# Altium schematic sheet USB HOST.SchDoc: USB HOST
size A4; Date: 30 08 2013; Author: Rachid AKKOUCHE; CompanyName: RASoftware; DrawnBy: Rachid AKKOUCHE; Engineer: Rachid AKKOUCHE; Organization: RASoftware; Address1: 52 J03, rue de la crèche; Address2: 77100 MEAUX; Address3: FRANCE; DocumentNumber: BRA201308309C; Revision: C; SheetNumber: 9; SheetTotal: 11; Telephone: +33651604047; Email: rachid.akkouche@wanadoo.fr; Proprietaire: MDI System; Dessinepar: -; Verifiepar: -; Time: 19:00
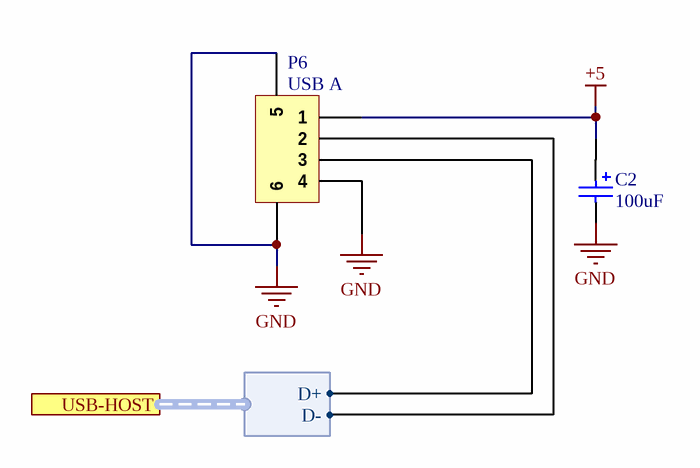
[diagram p0: USB HOST.SchDoc]

## Parts
C2  100uF  [Kemet_63]
P6  USB A  [USB  2410 06]

## Ports
USB-HOST (harness USB-HOST)

## Harnesses
USB-HOST: D-, D+

## Nets
+5: C2.1 P6.1
GND: C2.2 P6.4 P6.5 P6.6
NetP6_2: P6.2 ; port USB-HOST.D-
NetP6_3: P6.3 ; port USB-HOST.D+

## Notes on the sheet
- Ce document est la propriété de
- Project:
- Il ne peut être divulgué sans l'accord écrit de l'un de ses représentants dûment mandaté
- Title:
- Number:
- Date:
- Time:
- Size:
- A4
- Revision:
- Sheet
- of
- 52 J03 rue de la crèche
- Draw by:
- 77100 Meaux

## Library data of the parts
C2 = Cap Pol 100uF: Polarized Capacitor; Manufacturer: EPCOS; Manufacturer Part Number: B41142A4107M; Product Range: EPCOS - B41142 Series; Capacité: 100; Tolérance de capacité: ± 20%; Tension: 16; Type de boîtier de condensateur: Radial Can - SMD; Diamètre: 6.3; Résistance, ESR: 0.16; Hauteur: 7.7; Courant d'ondulation c.a.: 300; Type de packaging: Cut Tape; Durée de vie @ température: 2000 heures @ 105; Température d'utilisation min: -55; Température de fonctionnement max..: 105; SVHC: No SVHC (19-Dec-2012); Impédance: 0.26; Température de fonctionnement: -55°C à +105; Température, ESR: 20; Type de boîtier: CMS; Supplier 1: Farnell; RoHS: YES; Pricing 1: 10=0,123, 50=0,095, 100=0,078, 250=0,07, 1000=0,062 (EUR); Courant d'ondulation c.a. à  100Hz: 300; Fréquence, impédance: 100; Longueur/hauteur: 7.7; Température, courant ondulatoire: 105; Température, impédance: 20; ComponentLink1URL: http://www.epcos.com/inf/20/30/db/alu_x/B41142.pdf; ComponentLink1Description: http://www.epcos.com/inf/20/30/db/alu_x/B41142.pdf; Supplier Part Number 1: 1735328
P6 = Header 4_1: USB 2.0 Connector A; Manufacturer: LUMBERG; Manufacturer Part Number: 2410 06; Type de connecteur: USB Type A; Série: 2410; Genre: Embase; Nombre de contacts: 4; Terminaison du contact: A souder; Montage connecteur: CI; Plaquage du contact: Or; Matériau du contact: Cuivre; SVHC: No SVHC (19-Dec-2012); Body Plating: Etain; Courant: 1; Montage, orientation: 90°; Nombre de cycles d'accouplements: 1500; Plaquage borne: Tin; Résistance, contact: 30; Température de fonctionnement max..: +105; Température d'utilisation min: -55; Tension, vérification: 750; Type de montage: Montage en surface; Supplier 1: Farnell; Supplier Part Number 1: 1308874; RoHS: YES; Pricing 1: 1=0,63, 10=0,53, 50=0,51, 100=0,48 (EUR); Contact Material: CuSn; Tension c.a.: 30; ComponentLink1URL: http://www.farnell.com/datasheets/1715380.pdf; ComponentLink1Description: http://www.farnell.com/datasheets/1715380.pdf